# Altium project USB type C Breakout.PrjPcb
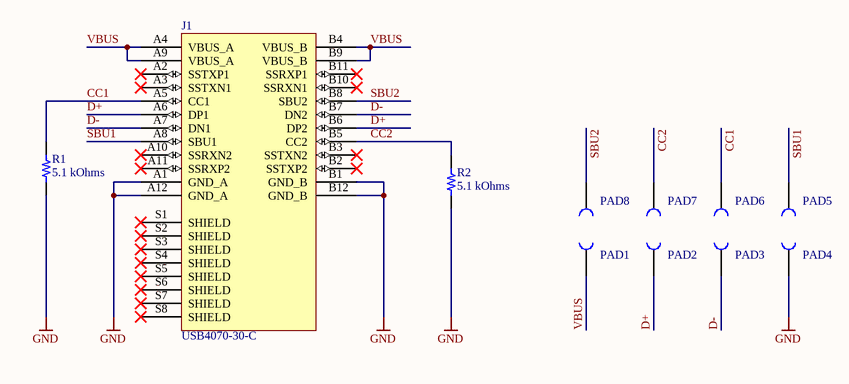
[diagram p0: USBC_BREAKOUT.SchDoc]
1 sheet, 11 parts. Net scope: global (net labels, ports and power ports of the same name join across sheets).
Board file: USBC_BREAKOUT.PcbDoc

## Sheet USBC_BREAKOUT.SchDoc
size A3; SheetNumber: 1; SheetTotal: 1

### Parts
J1  USB4070-30-C  [GCT_USB4070-30-C_REVC5]
PAD1  CastellatedPad  [CastellatedPad]  (value not drawn)
PAD2  CastellatedPad  [CastellatedPad]  (value not drawn)
PAD3  CastellatedPad  [CastellatedPad]  (value not drawn)
PAD4  CastellatedPad  [CastellatedPad]  (value not drawn)
PAD5  CastellatedPad  [CastellatedPad]  (value not drawn)
PAD6  CastellatedPad  [CastellatedPad]  (value not drawn)
PAD7  CastellatedPad  [CastellatedPad]  (value not drawn)
PAD8  CastellatedPad  [CastellatedPad]  (value not drawn)
R1  5.1 kOhms  [RES 0603_1608]
R2  5.1 kOhms  [RES 0603_1608]

### Nets
GND: J1.A1(GND_A) J1.A12(GND_A) J1.B1(GND_B) J1.B12(GND_B) PAD4.0 R1.1 R2.1
CC1: J1.A5(CC1) PAD6.0 R1.2
CC2: J1.B5(CC2) PAD7.0 R2.2
D+: J1.A6(DP1) J1.B6(DP2) PAD2.0
D-: J1.A7(DN1) J1.B7(DN2) PAD3.0
SBU1: J1.A8(SBU1) PAD5.0
SBU2: J1.B8(SBU2) PAD8.0
VBUS: J1.A4(VBUS_A) J1.A9(VBUS_A) J1.B4(VBUS_B) J1.B9(VBUS_B) PAD1.0

Not connected (* = marked no-connect by the designer): J1 A2(SSTXP1)* A3(SSTXN1)* A10(SSRXN2)* A11(SSRXP2)* B2(SSTXP2)* B3(SSTXN2)* B10(SSRXN1)* B11(SSRXP1)* S1(SHIELD)* S2(SHIELD)* S3(SHIELD)* S4(SHIELD)* S5(SHIELD)* S6(SHIELD)* S7(SHIELD)* S8(SHIELD)*

### Library data of the parts
J1 = USB4070-30-C: USB-C (USB TYPE-C) USB 3.2 Gen 2 (USB 3.1 Gen 2, Superspeed + (USB 3.1)) Receptacle Connector 24 Position Surface Mount, Through Hole; MF: Global Connector Technology; Check_prices: https://www.snapeda.com/parts/USB4070-30-C/Global%20Connector%20Technology/view-part/1212974/?ref=eda; MP: USB4070-30-C; Package: None; Price: None; Availability: In Stock; Purchase-URL: https://pricing.snapeda.com/search/part/USB4070-30-C/?ref=eda; SnapEDA_Link: https://www.snapeda.com/parts/USB4070-30-C/Global%20Connector%20Technology/view-part/1212974/?ref=snap; Value: *; Supplier 1: Newark; Supplier Part Number 1: 24AC9908
PAD1-PAD8 = CastellatedPad: Castellated Pad
R1 R2 = CRCW06035K10FKEA: RES SMD 5.1K OHM 1% 1/10W 0603; Manufacturer: Vishay Dale; Power (Watts): 0.1W, 1/10W; Temperature Coefficient: ±100ppm/°C; Part Number: CRCW06035K10FKEA; Value: 5.1 kOhms; ComponentLink1Description: Datasheet; ComponentLink1URL: http://www.vishay.com/docs/20035/dcrcwe3.pdf; ComponentLink2Description: DigiKey Link; ComponentLink2URL: https://www.digikey.com/en/products/detail/vishay-dale/CRCW06035K10FKEA/1174748; Composition: Thick Film; Device Package: 0603 (1608 Metric); Features: Automotive AEC-Q200; Height - Seated (Max): 0.020" (0.50mm); Lifecycle Status: Active; Minimum Order: 1; Number of Terminations: 2; Operating Temperature: -55°C ~ 155°C; Package / Case: 0603 (1608 Metric); Packaging: TapeAndReel; PartId: 12590; Part Status: Active; Price: 0.01; Ratings: AEC-Q200; Resistance: 5.1 kOhms; Series: CRCW; Size / Dimension: 0.061" L x 0.033" W (1.55mm x 0.85mm); Supplier 1: DigiKey; Supplier Part Number 1: 541-5.10KHCT-ND; Supplier Device Package: 0603; Tolerance: ±1%
  R1: LastUpdated: 19/09/2022 13:22:05
  R2: LastUpdated: 28/12/2022 21:08:01